# Altium schematic sheet SCH-1-Relay_circuit.SchDoc
size Letter
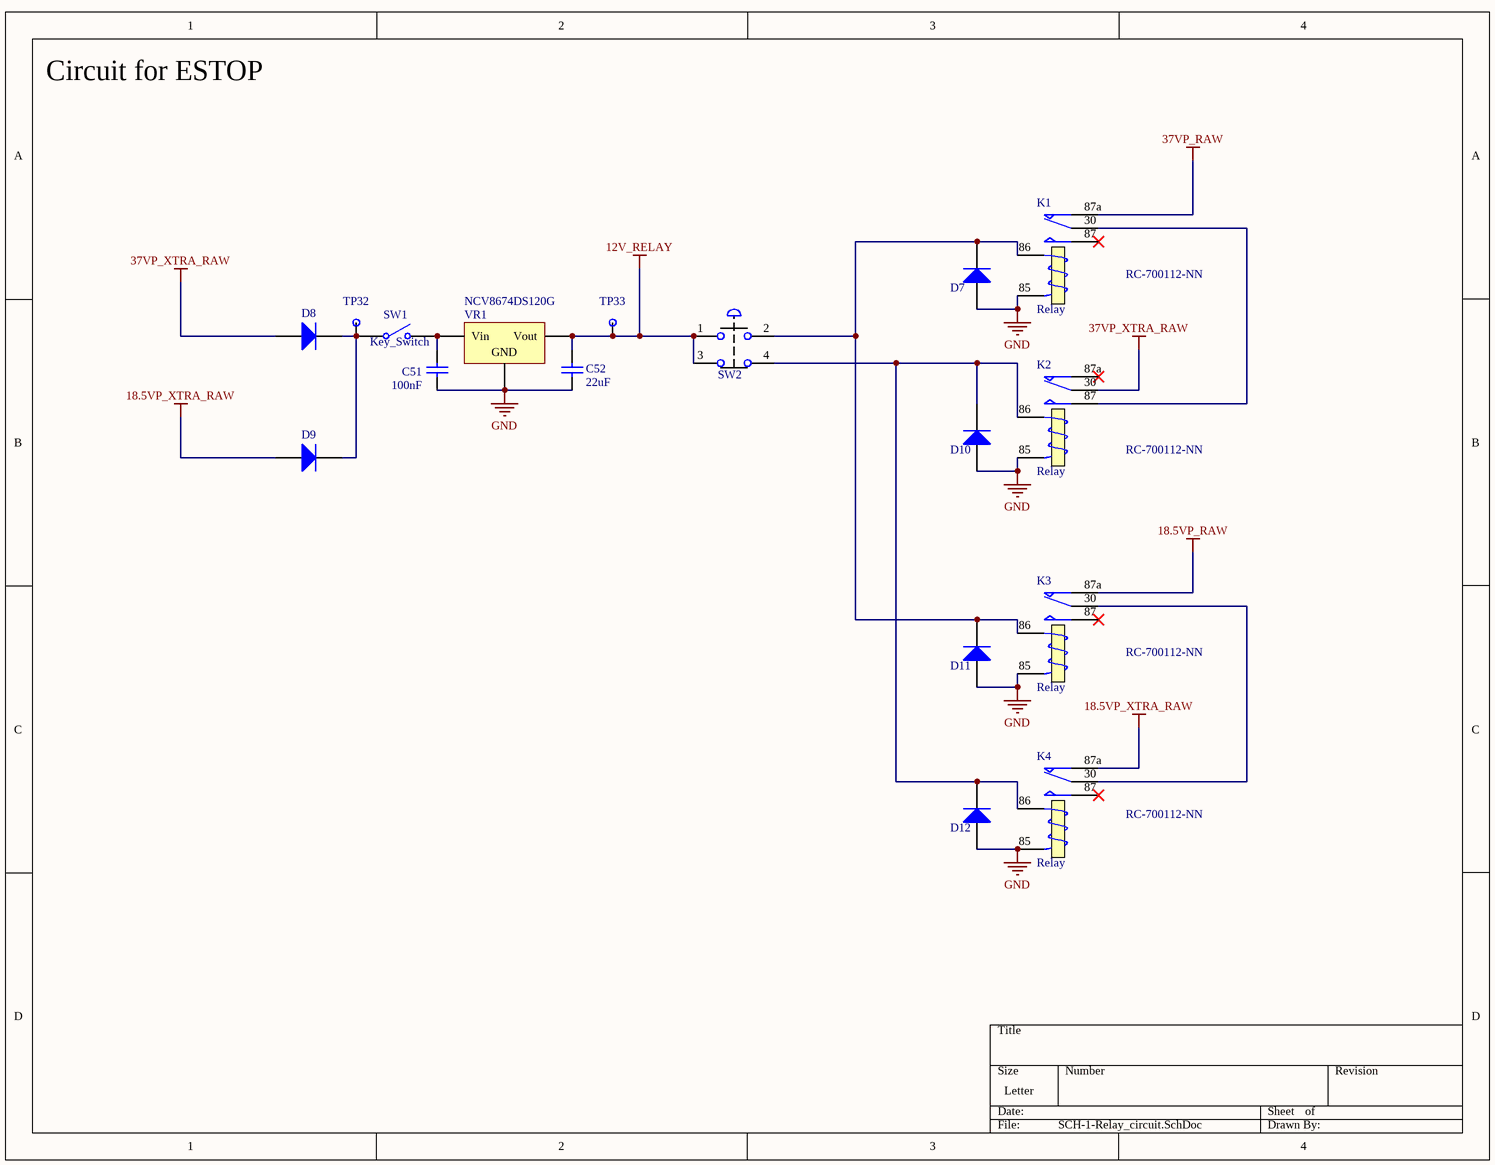
[diagram p0: SCH-1-Relay_circuit.SchDoc]

## Parts
C51  value 100nF  [1608[0603]]  (hidden comment: Cap)
C52  value 22uF  [1608[0603]]  (hidden comment: Cap)
D7  Diode 1N4001  [DO-41]  (value not drawn)
D8  Diode 1N4001  [DO-41]  (value not drawn)
D9  Diode 1N4001  [DO-41]  (value not drawn)
D10  Diode 1N4001  [DO-41]  (value not drawn)
D11  Diode 1N4001  [DO-41]  (value not drawn)
D12  Diode 1N4001  [DO-41]  (value not drawn)
K1  Relay  [Relay RC-700112-NN]
K2  Relay  [Relay RC-700112-NN]
K3  Relay  [Relay RC-700112-NN]
K4  Relay  [Relay RC-700112-NN]
SW1  Key_Switch  [MOLEX_0039293026]
SW2  NO-NC ESD with light  [MOLEX 0039281043]  (value not drawn)
TP32  TestPt  [50_MIL_PAD]  (value not drawn)
TP33  TestPt  [50_MIL_PAD]  (value not drawn)
VR1  Volt Reg  [DPAK254P1420X457-3N]  (value not drawn)

## Nets
12V_RELAY: C52.1 SW2.1 SW2.3 TP33.1 VR1.3(Vout)
18.5VP_RAW: K3.87a(NC)
18.5VP_XTRA_RAW: D9.1(A) K4.87a(NC)
37VP_RAW: K1.87a(NC)
37VP_XTRA_RAW: D8.1(A) K2.30(COM)
GND: C51.2 C52.2 D7.1(A) D10.1(A) D11.1(A) D12.1(A) K1.85(T2) K2.85(T2) K3.85(T2) K4.85(T2) VR1.2(GND)
NetC51_1: C51.1 SW1.2(NO) VR1.1(Vin)
NetD7_2: D7.2(K) D11.2(K) K1.86(T1) K3.86(T1) SW2.2
NetD8_2: D8.2(K) D9.2(K) SW1.1(COMMON) TP32.1
NetD10_2: D10.2(K) D12.2(K) K2.86(T1) K4.86(T1) SW2.4
NetK1_30: K1.30(COM) K2.87(NO)
NetK3_30: K3.30(COM) K4.30(COM)

Not connected (* = marked no-connect by the designer): K1 87(NO)*; K2 87a(NC)*; K3 87(NO)*; K4 87(NO)*

## Notes on the sheet
- Circuit for ESTOP
- (near VR1) NCV8674DS120G
- RC-700112-NN

## Library data of the parts
C51 C52 = Cap: Capacitor; Published: 8-Jun-2000; LatestRevisionDate: 17-Jul-2002; LatestRevisionNote: Re-released for DXP Platform.; PackageReference: RAD-0.3; Publisher: Altium Limited; PackageDescription: Radial Cap, Thru-Hole; 2 Leads; 0.3 in Pin Spacing
D7-D12 = Diode 1N4001: 1 Amp General Purpose Rectifier; Published: 8-Jun-2000; LatestRevisionDate: 17-Jul-2002; LatestRevisionNote: Re-released for DXP Platform.; DatasheetVersion: 1998; PackageVersion: Aug-1999; PackageReference: DO-41; Publisher: Altium Limited; PackageDescription: Diode, Axial; Body 5.2 x 2.7 mm (LxDia. max), Lead Dia. 0.86 mm (max); Code_JEDEC: DO-204-AL; ComponentLink1Description: Manufacturer Link; ComponentLink1URL: http://www.fairchildsemi.com/; ComponentLink2Description: Datasheet; ComponentLink2URL: http://www.fairchildsemi.com/ds/1N%2F1N4001.pdf
K1-K4 = Relay: SPDT Relay; Published: 8-Jun-2000; LatestRevisionDate: 17-Jul-2002; LatestRevisionNote: Re-released for DXP Platform.; PackageReference: MODULE5B; Publisher: Altium Limited
SW2 = DPST ESTOP
VR1 = Volt Reg: Voltage Regulator; Published: 24-Mar-1999; LatestRevisionDate: 29-May-2009; LatestRevisionNote: IPC-7351 Footprint Added.; PackageReference: D2PAK; Publisher: Altium Limited; PackageDescription: 3-Pin Transistor Outline Package 2.54 mm Pitch, 15.1 mm Lead Span
SW1 = Key_Switch: Published: 24-Mar-1999; LatestRevisionDate: 17-Jul-2002; LatestRevisionNote: Re-released for DXP Platform.; PackageReference: SPST-2; Publisher: Altium Limited; PackageDescription: Switch; 2 Leads